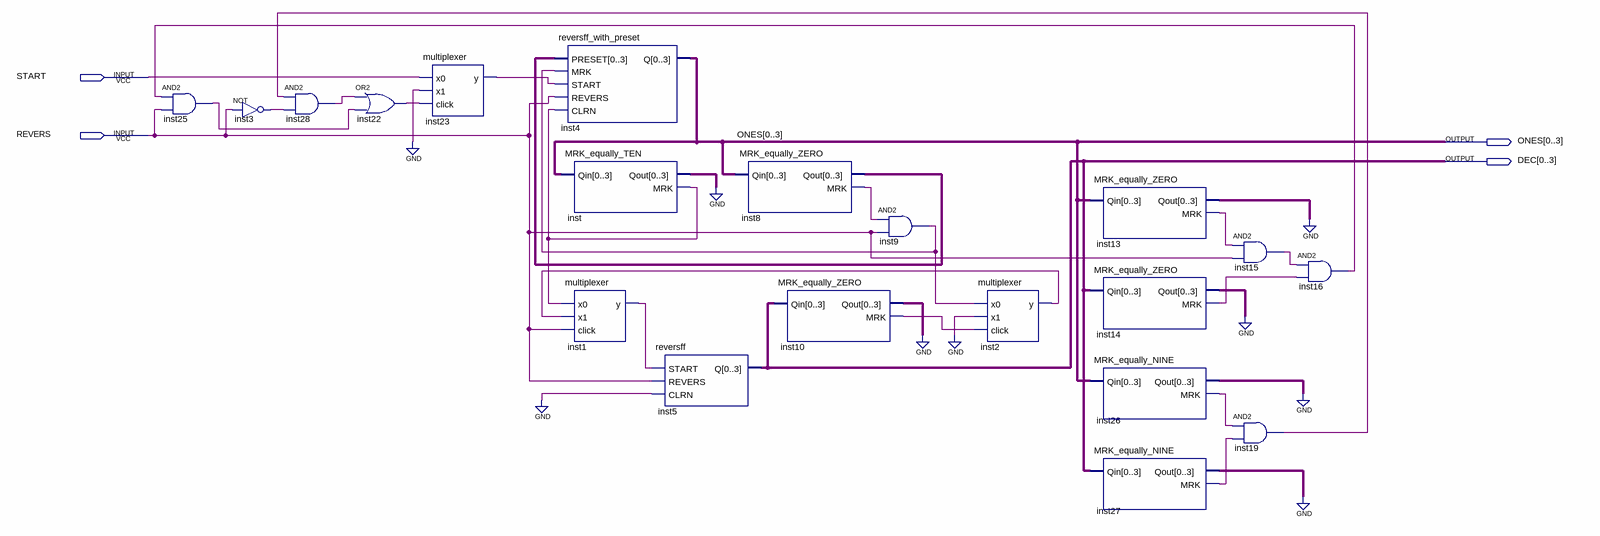
[diagram p0: schematic sheet]
// Quartus schematic counter.bdf as structural Verilog: 20 symbols, 4 pins
module counter (
  input  START,
  input  REVERS,
  output [0:3] ONES,
  output [0:3] DEC
);

  wire inst1_y, inst2_y, inst3_out, inst8_mrk, inst9_out, inst10_mrk, inst13_mrk, inst14_mrk, inst15_out,
       inst16_out, inst19_out, inst22_out, inst23_y, inst25_out, inst26_mrk, inst27_mrk, inst28_out, inst_mrk;
  wire [3:0] inst8_qout, inst10_qout, inst13_qout, inst14_qout, inst26_qout, inst27_qout, inst_qout;

  and inst25 (inst25_out, inst16_out, REVERS);
  not inst3 (inst3_out, REVERS);
  and inst28 (inst28_out, inst19_out, inst3_out);
  or inst22 (inst22_out, inst28_out, inst25_out);
  multiplexer inst23 (.x0(START), .x1(1'b0), .click(inst22_out), .y(inst23_y));
  reversff_with_preset inst4 (
    .PRESET(inst8_qout), .MRK(inst9_out), .START(inst23_y), .REVERS(REVERS), .CLRN(inst_mrk), .Q(ONES));
  MRK_equally_TEN inst (.Qin(ONES), .Qout(inst_qout), .MRK(inst_mrk));
  multiplexer inst1 (.x0(inst_mrk), .x1(inst2_y), .click(REVERS), .y(inst1_y));
  reversff inst5 (.START(inst1_y), .REVERS(REVERS), .CLRN(1'b0), .Q(DEC));
  MRK_equally_ZERO inst8 (.Qin(ONES), .Qout(inst8_qout), .MRK(inst8_mrk));
  MRK_equally_ZERO inst10 (.Qin(DEC), .Qout(inst10_qout), .MRK(inst10_mrk));
  and inst9 (inst9_out, inst8_mrk, REVERS);
  multiplexer inst2 (.x0(inst9_out), .x1(1'b0), .click(inst10_mrk), .y(inst2_y));
  MRK_equally_ZERO inst13 (.Qin(ONES), .Qout(inst13_qout), .MRK(inst13_mrk));
  MRK_equally_ZERO inst14 (.Qin(DEC), .Qout(inst14_qout), .MRK(inst14_mrk));
  MRK_equally_NINE inst26 (.Qin(ONES), .Qout(inst26_qout), .MRK(inst26_mrk));
  MRK_equally_NINE inst27 (.Qin(DEC), .Qout(inst27_qout), .MRK(inst27_mrk));
  and inst15 (inst15_out, inst13_mrk, REVERS);
  and inst19 (inst19_out, inst26_mrk, inst27_mrk);
  and inst16 (inst16_out, inst15_out, inst14_mrk);
  // also tied to GND on the sheet: {inst_qout[0], inst_qout[1], inst_qout[2], inst_qout[3], inst10_qout[0], inst10_qout[1], inst10_qout[2], inst10_qout[3], inst13_qout[0], inst13_qout[1], inst13_qout[2], inst13_qout[3], inst14_qout[0], inst14_qout[1], inst14_qout[2], inst14_qout[3], inst26_qout[0], inst26_qout[1], inst26_qout[2], inst26_qout[3], inst27_qout[0], inst27_qout[1], inst27_qout[2], inst27_qout[3]}
endmodule
